# Altium schematic sheet wifi-module.SchDoc: EURO POWER WIFI (part 2 of 2)
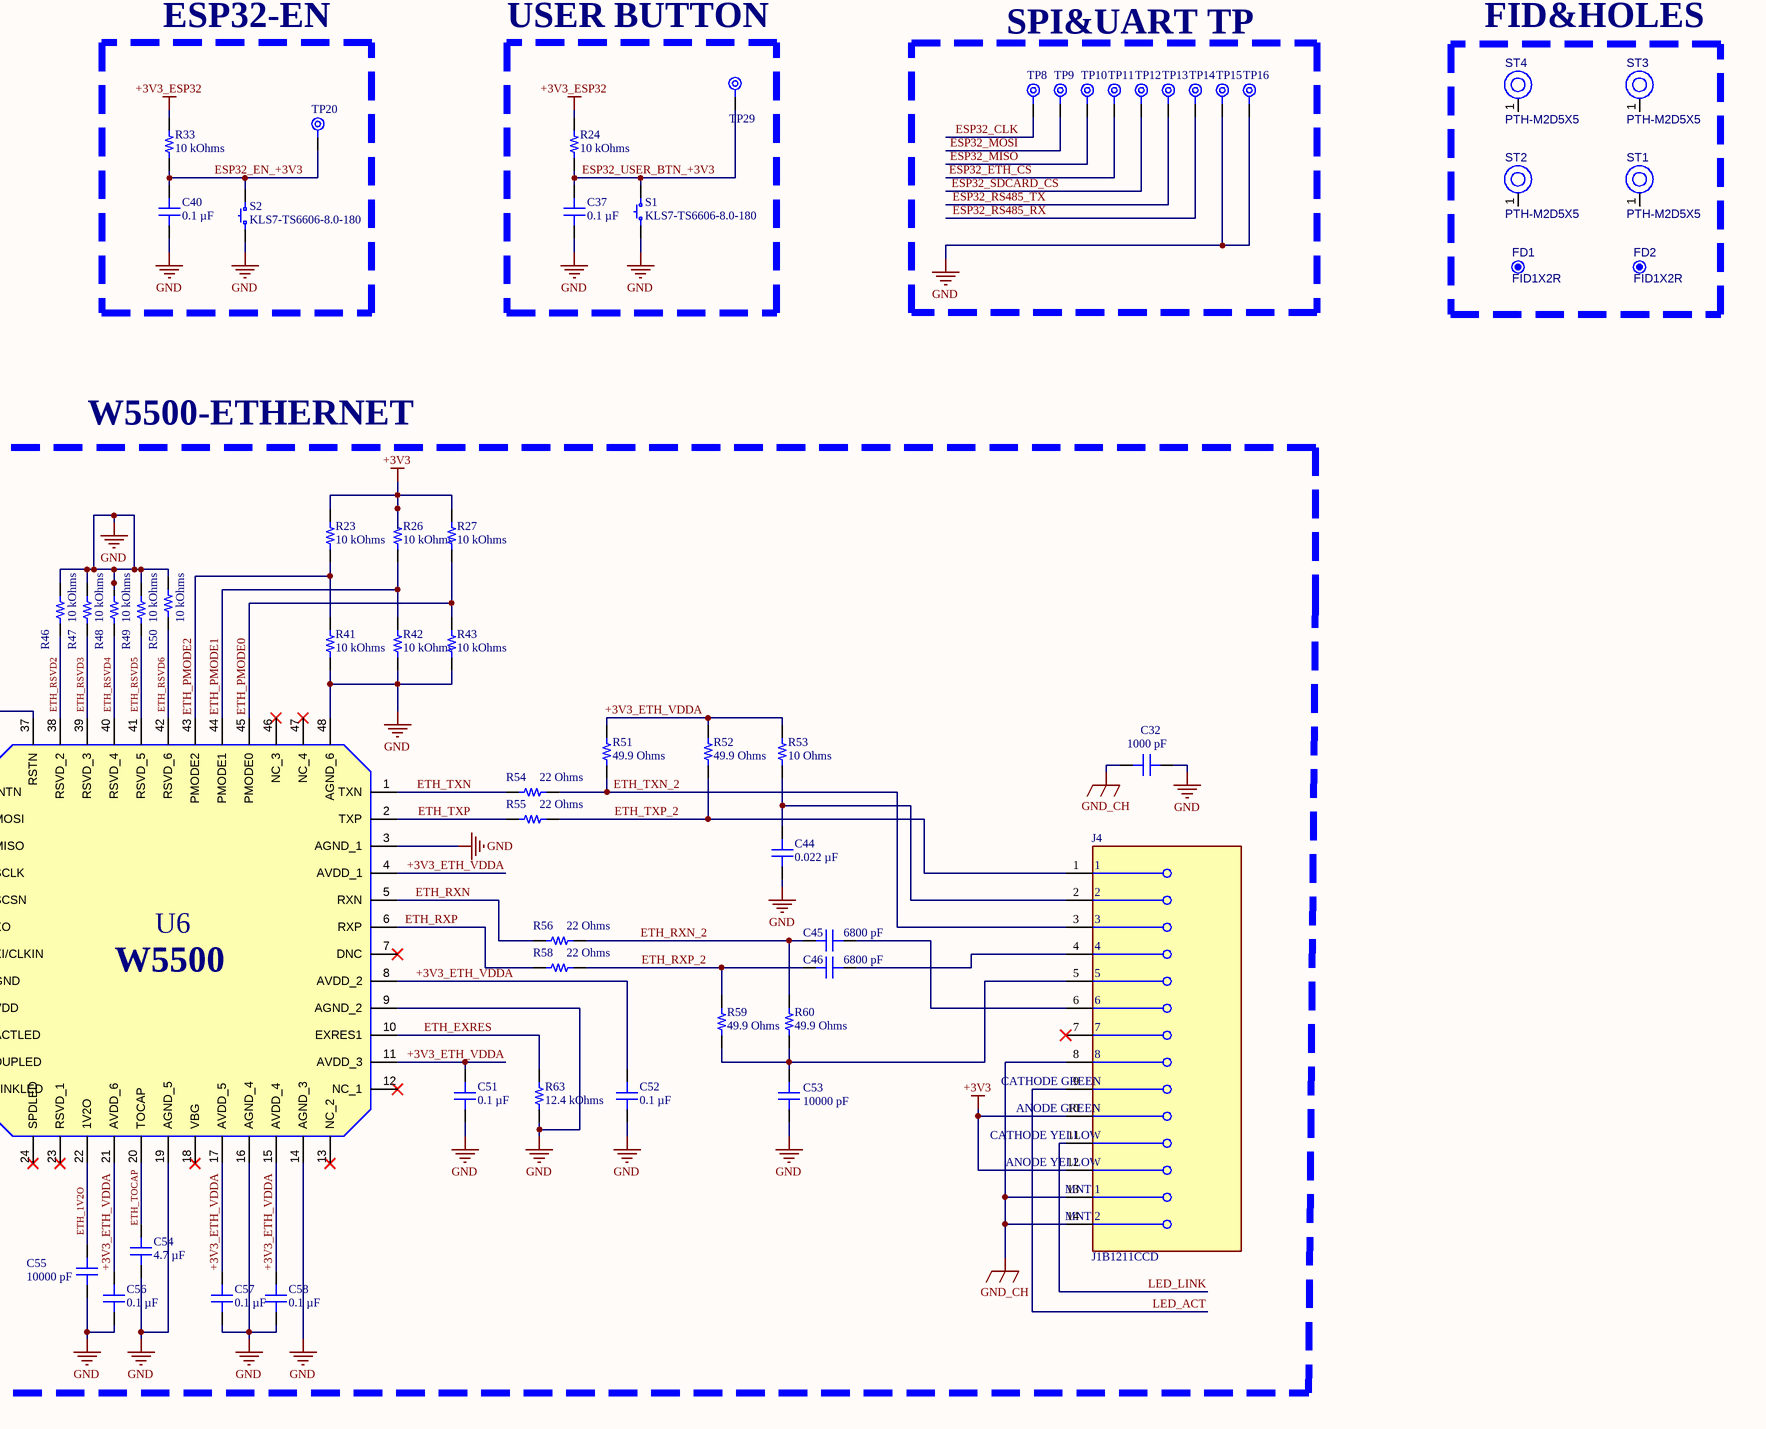
[diagram p4: wifi-module.SchDoc, bottom right]

## Library data of the parts
BR1 = ABS210: Bridge Rectifier; Manufacturer_Name: MDD; Datasheet Link: https://datasheet.lcsc.com/szlcsc/1903041530_MDD-Jiangsu-Yutai-Elec-ABS210_C113925.pdf; Height: 1.6mm; Manufacturer_Part_Number: ABS210
C1 C18 = CMP-214-008774-1: CAP CER 1000PF 50V X7R 0603; manufacturer: KEMET; Tolerance: ±10%; partid: 47213; Device Package: 0603 (1608 Metric); Lifecycle Status: Active; Operating Temperature: -55°C ~ 125°C; Capacitance: 1000 pF; lastupdated: 9/4/2023 7:08:10 PM; price: 0.01; Package / Case: 0603 (1608 Metric); Part Status: Active; series: SMD Auto X7R; Voltage - Rated: 50V; Part Number: C0603C102K5RACAUTO7411; ComponentLink1URL: https://connect.kemet.com:7667/gateway/IntelliData-ComponentDocumentation/1.0/download/datasheet/C0603C102K5RACAUTO7411; ComponentLink2URL: https://www.digikey.com/en/products/detail/kemet/C0603C102K5RACAUTO7411/11676491; Mounting Type: Surface Mount, MLCC; Ratings: AEC-Q200; Applications: Automotive, Bypass, Decoupling; ComponentLink2Description: DigiKey Link; packaging: TapeAndReel; Thickness (Max): 0.034" (0.87mm); Minimum Order: 1; Temperature Coefficient: X7R; Size / Dimension: 0.063" L x 0.031" W (1.60mm x 0.80mm); ComponentLink1Description: Datasheet
C2 C3 = CMP-001-00289-1: WCAP-ATG8 Aluminum Electrolytic Capacitor, Radial, THT, D8 x H11.5mm, 4.7uF, 400V; Manufacturer: Wurth Elektronik; Ripple Current: 55mA; Capacitance Tolerance: +/-20%; Leakage Current: 56.4uA; Simulation File: Simulations\WCAP-ATG8.ckt; Endurance: 2000h; Technical Reference: ATAE1154R7M400DSPA7B000; Simulation ModelName: 860011374005_4.7uF; Dissipation Factor: 15%; ComponentLink2URL: https://www.we-online.com/redexpert/spec/860011374005?ad; Operating Temperature Max: 85°C; Category: Aluminum Electrolytic Capacitors; Mount: Through Hole; Match Code: WCAP-ATG8; Height: 11.5mm; Diameter: 8mm; Rated Voltage (DC): 400V; Packaging: Ammo Pack; Manufacturer Part Number: 860011374005; ComponentLink1URL: https://www.we-online.com/redexpert/article/860011374005?ad; ComponentLink1Description: Website Link; Operating Temperature Min: -25°C; ComponentLink2Description: Datasheet Link
C4 C7 C8 C12 C16 C21 C24 C25 C28 C31 C34 C36 C37 C39 C40 C48 C50-C52 C56-C58 = CMP-214-002418-1: CAP CER 0.1UF 50V X7R 0603; manufacturer: Yageo; Tolerance: ±5%; Operating Temperature: -55°C ~ 125°C; Size / Dimension: 0.063" L x 0.031" W (1.60mm x 0.80mm); Minimum Order: 1; Capacitance: 0.1 µF; Temperature Coefficient: X7R; Thickness (Max): 0.035" (0.90mm); Lifecycle Status: Active; Part Number: CC0603JRX7R9BB104; ComponentLink2Description: DigiKey Link; lastupdated: 9/4/2023 7:08:38 PM; ComponentLink2URL: https://www.digikey.com/en/products/detail/yageo/CC0603JRX7R9BB104/5195188; Device Package: 0603 (1608 Metric); price: 0.01; partid: 12474; ComponentLink1Description: Datasheet; Applications: General Purpose; Mounting Type: Surface Mount, MLCC; Package / Case: 0603 (1608 Metric); Part Status: Active; ComponentLink1URL: https://www.yageo.com/upload/media/product/productsearch/datasheet/mlcc/UPY-GPHC_X7R_6.3V-to-50V_18.pdf; series: CC; Voltage - Rated: 50V; packaging: TapeAndReel
C5 C6 C9-C11 C15 C26 C41 = CMP-215-002141-1: CAP CER 10UF 25V X5R 0805; manufacturer: Samsung Electro-Mechanics; Tolerance: ±10%; ComponentLink2Description: DigiKey Link; Operating Temperature: -55°C ~ 85°C; Part Number: CL21A106KAYNNNE; ComponentLink1Description: Datasheet; Package / Case: 0805 (2012 Metric); series: CL; Minimum Order: 1; price: 0.02; Capacitance: 10 µF; Size / Dimension: 0.079" L x 0.049" W (2.00mm x 1.25mm); Voltage - Rated: 25V; Thickness (Max): 0.057" (1.45mm); partid: 13105; Device Package: 0805 (2012 Metric); Temperature Coefficient: X5R; Part Status: Active; Applications: General Purpose; Lifecycle Status: Active; ComponentLink2URL: https://www.digikey.com/en/products/detail/samsung-electro-mechanics/CL21A106KAYNNNE/3888549; lastupdated: 9/4/2023 7:11:56 PM; packaging: TapeAndReel; ComponentLink1URL: http://www.samsungsem.com/kr/support/product-search/mlcc/CL21A106KAYNNNE.jsp; Mounting Type: Surface Mount, MLCC
C13 = CMP-214-001809-1: CAP CER 0.022UF 50V X7R 0603; manufacturer: Samsung Electro-Mechanics; Tolerance: ±10%; Applications: General Purpose; ComponentLink2URL: https://www.digikey.com/en/products/detail/samsung-electro-mechanics/CL10B223KB8NNNC/3886762; Temperature Coefficient: X7R; Package / Case: 0603 (1608 Metric); Thickness (Max): 0.035" (0.90mm); packaging: TapeAndReel; ComponentLink1URL: http://www.samsungsem.com/kr/support/product-search/mlcc/CL10B223KB8NNNC.jsp; price: 0.01; Lifecycle Status: Active; Operating Temperature: -55°C ~ 125°C; Mounting Type: Surface Mount, MLCC; series: CL; partid: 9905; lastupdated: 9/4/2023 7:08:42 PM; Minimum Order: 1; Part Status: Active; Size / Dimension: 0.063" L x 0.031" W (1.60mm x 0.80mm); Voltage - Rated: 50V; Capacitance: 0.022 µF; Device Package: 0603 (1608 Metric); Part Number: CL10B223KB8NNNC; ComponentLink1Description: Datasheet; ComponentLink2Description: DigiKey Link
C14 = CMP-209-000859-1: CAP ALUM POLY 100UF 20% 35V SMD; manufacturer: KEMET; Surface Mount Land Size: 0.327" L x 0.327" W (8.30mm x 8.30mm); Ripple Current @ High Frequency: 1.4 A @ 100 kHz; Type: Polymer; Lifetime @ Temp.: 2000 Hrs @ 125°C; ESR (Equivalent Series Resistance): 36mOhm; Ripple Current @ Low Frequency: 70 mA @ 120 Hz; ComponentLink1URL: https://connect.kemet.com:7667/gateway/IntelliData-ComponentDocumentation/1.0/download/datasheet/A768KE107M1VLAE036; Tolerance: ±20%; packaging: TapeAndReel; Lifecycle Status: Active; Height - Seated (Max): 0.236" (6.00mm); Part Status: Active; price: 0.16; Voltage - Rated: 35 V; series: A768; lastupdated: 9/4/2023 8:34:42 PM; Size / Dimension: 0.315" Dia (8.00mm); Mounting Type: Surface Mount; Minimum Order: 1; Part Number: A768KE107M1VLAE036; partid: 5230; ComponentLink2URL: https://www.digikey.com/en/products/detail/kemet/A768KE107M1VLAE036/13420090; ComponentLink2Description: DigiKey Link; Capacitance: 100 µF; ComponentLink1Description: Datasheet; Operating Temperature: -55°C ~ 125°C; Applications: General Purpose
C17 C22 C53 C55 = CMP-214-000783-1: CAP CER 10000PF 50V X7R 0603; manufacturer: Samsung Electro-Mechanics; Tolerance: ±10%; Lifecycle Status: Active; Capacitance: 10000 pF; price: 0.01; Thickness (Max): 0.035" (0.90mm); Minimum Order: 1; Part Status: Active; Device Package: 0603 (1608 Metric); ComponentLink2Description: DigiKey Link; packaging: TapeAndReel; series: CL; Voltage - Rated: 50V; Size / Dimension: 0.063" L x 0.031" W (1.60mm x 0.80mm); lastupdated: 9/4/2023 7:08:47 PM; partid: 5498; ComponentLink1Description: Datasheet; ComponentLink2URL: https://www.digikey.com/en/products/detail/samsung-electro-mechanics/CL10B103KB8NNNC/3886667; Part Number: CL10B103KB8NNNC; Package / Case: 0603 (1608 Metric); Mounting Type: Surface Mount, MLCC; Temperature Coefficient: X7R; Operating Temperature: -55°C ~ 125°C; Applications: General Purpose; ComponentLink1URL: http://www.samsungsem.com/kr/support/product-search/mlcc/CL10B103KB8NNNC.jsp
C19 C23 C29 = CMP-214-001827-1: CAP CER 100PF 50V C0G/NP0 0603; manufacturer: Samsung Electro-Mechanics; Temperature Coefficient: C0G, NP0; Tolerance: ±5%; Voltage - Rated: 50V; Size / Dimension: 0.063" L x 0.031" W (1.60mm x 0.80mm); price: 0.01; series: CL; Operating Temperature: -55°C ~ 125°C; ComponentLink2Description: DigiKey Link; ComponentLink2URL: https://www.digikey.com/en/products/detail/samsung-electro-mechanics/CL10C101JB81PNC/3887820; Package / Case: 0603 (1608 Metric); Thickness (Max): 0.035" (0.90mm); Capacitance: 100 pF; Ratings: AEC-Q200; packaging: TapeAndReel; Lifecycle Status: Active; partid: 9987; Minimum Order: 1; ComponentLink1Description: Datasheet; Device Package: 0603 (1608 Metric); lastupdated: 9/4/2023 7:08:42 PM; Mounting Type: Surface Mount, MLCC; Part Number: CL10C101JB81PNC; Part Status: Active; ComponentLink1URL: http://www.samsungsem.com/kr/support/product-search/mlcc/CL10C101JB81PNC.jsp; Applications: Automotive
C20 C27 C33 C35 C38 C49 = CMP-214-007386-1: CAP CER 10UF 6.3V X5R 0603; manufacturer: Samsung Electro-Mechanics; Tolerance: ±20%; Part Status: Active; ComponentLink2Description: DigiKey Link; ComponentLink1URL: http://www.samsungsem.com/kr/support/product-search/mlcc/CL10A106MQ8NNNC.jsp; partid: 39822; Thickness (Max): 0.035" (0.90mm); Voltage - Rated: 6.3V; Device Package: 0603 (1608 Metric); Lifecycle Status: Active; Mounting Type: Surface Mount, MLCC; Operating Temperature: -55°C ~ 85°C; Temperature Coefficient: X5R; packaging: TapeAndReel; ComponentLink2URL: https://www.digikey.com/en/products/detail/samsung-electro-mechanics/CL10A106MQ8NNNC/3886777; Applications: General Purpose; series: CL; Part Number: CL10A106MQ8NNNC; Minimum Order: 1; Size / Dimension: 0.063" L x 0.031" W (1.60mm x 0.80mm); ComponentLink1Description: Datasheet; lastupdated: 9/4/2023 7:08:47 PM; Capacitance: 10 µF; Package / Case: 0603 (1608 Metric); price: 0.01
C30 = CMP-216-004562-1: CAP CER 2200PF 2KV X7R 1206; manufacturer: KEMET; Voltage - Rated: 2000V (2kV); Tolerance: ±10%; Mounting Type: Surface Mount, MLCC; price: 0.16; Package / Case: 1206 (3216 Metric); Operating Temperature: -55°C ~ 125°C; Lifecycle Status: Active; Device Package: 1206 (3216 Metric); ComponentLink2URL: https://www.digikey.com/en/products/detail/kemet/C1206X222KGRAC7800/6126197; lastupdated: 9/4/2023 7:14:42 PM; ComponentLink2Description: DigiKey Link; Part Status: Active; Thickness (Max): 0.073" (1.85mm); Temperature Coefficient: X7R; series: SMD Comm X7R HV Flex; ComponentLink1Description: Datasheet; Applications: Boardflex Sensitive; partid: 41595; Part Number: C1206X222KGRAC7800; packaging: TapeAndReel; Minimum Order: 1; Capacitance: 2200 pF; ComponentLink1URL: https://api.kemet.com/component-edge/download/datasheet/C1206X222KGRAC7800.pdf; Features: Low ESL, Soft Termination, High Voltage; Size / Dimension: 0.130" L x 0.063" W (3.30mm x 1.60mm)
C32 = CMP-216-005573-1: CAP CER 1000PF 2KV X7R 1206; manufacturer: Johanson Dielectrics Inc.; Tolerance: ±10%; Voltage - Rated: 2000V (2kV); Temperature Coefficient: X7R; packaging: TapeAndReel; Capacitance: 1000 pF; Applications: SMPS Filtering; Size / Dimension: 0.125" L x 0.062" W (3.18mm x 1.57mm); series: HVS-PME; ComponentLink1URL: https://www.johansondielectrics.com/downloads/catalog/johanson-dielectrics-product-catalog.pdf; Minimum Order: 1; ComponentLink2URL: https://www.digikey.com/en/products/detail/johanson-dielectrics-inc/VPDD202W102K1GV001E/1556359; Mounting Type: Surface Mount, MLCC; ComponentLink1Description: Datasheet; Package / Case: 1206 (3216 Metric); Features: High Voltage; Device Package: 1206 (3216 Metric); lastupdated: 9/4/2023 7:13:44 PM; ComponentLink2Description: DigiKey Link; Part Number: VPDD202W102K1GV001E; Operating Temperature: -55°C ~ 125°C; price: 0.02; Thickness (Max): 0.067" (1.70mm); Part Status: Active; partid: 47912; Lifecycle Status: Active
C42 = CMP-001-03429-1: WCAP-FTX2 Film Capacitor, THT, L15 x W7 x H12.5mm, 220nF, 275V; Manufacturer: Wurth Elektronik; Pitch: 12.5mm; Rate of Voltage Rise: 240V/us; Technical Reference: MX2P125224K275ASPB15000; Simulation ModelName: 890324024002_220nF; Dissipation Factor @1kHz: 0.1%; Dissipation Factor @100kHz: 2%; Insulation Resistance: 30GOhm; Simulation File: Simulations\WCAP-FTX2.ckt; Dissipation Factor @10kHz: 0.2%; Capacitance Tolerance: +/-10%; Manufacturer Part Number: 890324024002; Length: 15mm; Category: Film Capacitors; ComponentLink2Description: Datasheet Link; Operating Temperature Max: 105°C; Packaging: Carton; Match Code: WCAP-FTX2; ComponentLink1URL: https://www.we-online.com/redexpert/article/890324024002?ad; ComponentLink2URL: https://www.we-online.com/redexpert/spec/890324024002?ad; ComponentLink1Description: Website Link; Mount: Through Hole; Width: 7mm; Operating Temperature Min: -40°C; Rated Voltage (AC): 275V; Height: 12.5mm
C43 C47 = CMP-214-005657-1: CAP CER 0603 18PF 50V ULTRA STAB; manufacturer: KEMET; Temperature Coefficient: X8R; Tolerance: ±10%; price: 0.01; Minimum Order: 1; ComponentLink2Description: DigiKey Link; Device Package: 0603 (1608 Metric); Features: Low ESL, High Temperature; packaging: TapeAndReel; lastupdated: 9/4/2023 7:08:19 PM; Voltage - Rated: 50V; ComponentLink2URL: https://www.digikey.com/en/products/detail/kemet/C0603C180K5HACAUTO/7957267; Lifecycle Status: Active; Mounting Type: Surface Mount, MLCC; Part Number: C0603C180K5HACAUTO; Thickness (Max): 0.034" (0.87mm); ComponentLink1URL: https://api.kemet.com/component-edge/download/datasheet/C0603C180K5HACAUTO.pdf; Capacitance: 18 pF; Size / Dimension: 0.063" L x 0.031" W (1.60mm x 0.80mm); Ratings: AEC-Q200; partid: 35316; Applications: Automotive; Part Status: Active; Package / Case: 0603 (1608 Metric); ComponentLink1Description: Datasheet; Operating Temperature: -55°C ~ 150°C; series: SMD Auto X8R HT150C
C44 = CMP-214-009207-1: CAP CER 0.022UF 50V X7R 0603; manufacturer: KEMET; Tolerance: ±20%; packaging: TapeAndReel; price: 0.01; Applications: Automotive, Bypass, Decoupling; ComponentLink1Description: Datasheet; Size / Dimension: 0.063" L x 0.031" W (1.60mm x 0.80mm); Mounting Type: Surface Mount, MLCC; series: SMD Auto X7R; partid: 48455; ComponentLink2Description: DigiKey Link; Part Number: C0603C223M5RACAUTO; Package / Case: 0603 (1608 Metric); Ratings: AEC-Q200; Part Status: Active; Device Package: 0603 (1608 Metric); Capacitance: 0.022 µF; Temperature Coefficient: X7R; Minimum Order: 1; Operating Temperature: -55°C ~ 125°C; Thickness (Max): 0.034" (0.87mm); Lifecycle Status: Active; lastupdated: 9/4/2023 7:08:04 PM; ComponentLink2URL: https://www.digikey.com/en/products/detail/kemet/C0603C223M5RACAUTO/11676307; Voltage - Rated: 50V; ComponentLink1URL: https://connect.kemet.com:7667/gateway/IntelliData-ComponentDocumentation/1.0/download/datasheet/C0603C223M5RACAUTO
C45 C46 = CMP-214-005416-1: CAP CER 6800PF 50V X7R 0603; manufacturer: KEMET; Tolerance: ±10%; partid: 35033; ComponentLink1Description: Datasheet; price: 0.01; Part Status: Active; packaging: TapeAndReel; Device Package: 0603 (1608 Metric); Applications: Bypass, Decoupling; Part Number: C0603C682K5RAC7411; Voltage - Rated: 50V; ComponentLink2URL: https://www.digikey.com/en/products/detail/kemet/C0603C682K5RAC7411/12701123; Operating Temperature: -55°C ~ 125°C; ComponentLink2Description: DigiKey Link; ComponentLink1URL: https://api.kemet.com/component-edge/download/datasheet/C0603C682K5RAC7411.pdf; Mounting Type: Surface Mount, MLCC; Thickness (Max): 0.034" (0.87mm); Minimum Order: 1; Temperature Coefficient: X7R; series: SMD Comm X7R; Package / Case: 0603 (1608 Metric); Size / Dimension: 0.063" L x 0.031" W (1.60mm x 0.80mm); lastupdated: 9/4/2023 7:08:18 PM; Lifecycle Status: Active; Capacitance: 6800 pF
C54 = CMP-216-004449-1: CAP CER 4.7UF 50V X7R 1206; manufacturer: Samsung Electro-Mechanics; Tolerance: ±10%; Package / Case: 1206 (3216 Metric); partid: 40975; Operating Temperature: -55°C ~ 125°C; Thickness (Max): 0.071" (1.80mm); Part Status: Active; Lifecycle Status: Active; ComponentLink1Description: Datasheet; ComponentLink2Description: DigiKey Link; series: CL; Size / Dimension: 0.126" L x 0.063" W (3.20mm x 1.60mm); price: 0.05; Applications: General Purpose; Part Number: CL31B475KBHNNNE; Device Package: 1206 (3216 Metric); Capacitance: 4.7 µF; Minimum Order: 1; packaging: TapeAndReel; ComponentLink2URL: https://www.digikey.com/en/products/detail/samsung-electro-mechanics/CL31B475KBHNNNE/3888447; Temperature Coefficient: X7R; Voltage - Rated: 50V; ComponentLink1URL: http://www.samsungsem.com/kr/support/product-search/mlcc/CL31B475KBHNNNE.jsp; Mounting Type: Surface Mount, MLCC; lastupdated: 9/4/2023 7:14:47 PM
D3 D4 = CMP-254-002514-1: SCHOTTKY 40V SOD-123FL; Manufacturer: SMC Diode Solutions; Capacitance @ Vr, F: 110pF @ 4V, 1MHz; Current - Reverse Leakage @ Vr: 100 µA @ 40 V; Current - Average Rectified (Io): 1A; Speed: Fast Recovery =< 500ns, > 200mA (Io); Voltage - Forward (Vf) (Max) @ If: 500 mV @ 1 A; Price: 0.03; Packaging: TapeAndReel; PartId: 2515; ComponentLink2URL: https://www.digikey.com/en/products/detail/smc-diode-solutions/DSS14UTR/8341859; Part Number: DSS14UTR; Diode Type: Schottky; ComponentLink2Description: DigiKey Link; Voltage - DC Reverse (Vr) (Max): 40 V; ComponentLink1URL: http://www.smc-diodes.com/propdf/DSS12U%20THRU%20DSS125U%20N1873%20REV.A.pdf; Supplier Device Package: SOD-123FL; Minimum Order: 1; Part Status: Active; ComponentLink1Description: Datasheet; LastUpdated: 9/4/2023 8:16:26 PM; Package / Case: SOD-123F; Series: -; Operating Temperature - Junction: -55°C ~ 150°C; Lifecycle Status: Active; Mounting Type: Surface Mount
D5 = CMP-004-00002-2: Fast Switching Diode, 75 V, 0.3 A, -65 to 150 degC, 2-Pin SOD323, RoHS, Tape and Reel; Manufacturer: Diodes Inc; Peak Reverse Current: 1uA; Max Surge Current: 2A; Elements: 1; Forward Current: 300mA; Recovery Time: 4ns; Forward Voltage: 1.25V; Datasheet Version: Rev. 25-2, 03/2016; Case/Package: SOD; Min Operating Temperature: -65°C; RoHS Compliant: True; Max Operating Temperature: 150°C; Manufacturer URL: http://www.diodes.com/; Pins: 2; Package Quantity: 3000; Datasheet URL: http://www.diodes.com/datasheets/ds30097.pdf; Packaging: TapeandReel; Package Description: 2-Pin Small Outline Diode, Body 1.7 x 1.3 mm; Mounting Technology: SM; Package Reference: SOD323-2
D6 = CMP-254-000890-1: DIODE GEN PURP 1KV 1A DO214AC; Manufacturer: Micro Commercial Co; Current - Reverse Leakage @ Vr: 5 µA @ 1000 V; Voltage - Forward (Vf) (Max) @ If: 1.5 V @ 1 A; Diode Type: Standard; Capacitance @ Vr, F: 8pF @ 4V, 1MHz; Speed: Fast Recovery =< 500ns, > 200mA (Io); Voltage - DC Reverse (Vr) (Max): 1000 V; Reverse Recovery Time (trr): 120 ns; Mounting Type: Surface Mount; Part Number: US1ML-TP; Current - Average Rectified (Io): 1A; Operating Temperature - Junction: -55°C ~ 150°C; Supplier Device Package: DO-214AC (SMA); Packaging: TapeAndReel; PartId: 891; Minimum Order: 1; ComponentLink1Description: Datasheet; Price: 0.04; LastUpdated: 9/4/2023 8:16:02 PM; ComponentLink2URL: https://www.digikey.com/en/products/detail/micro-commercial-co/US1ML-TP/7681879; Lifecycle Status: Active; Series: -; ComponentLink1URL: https://www.mccsemi.com/pdf/Products/US1ML(DO-214AC)-A.pdf; ComponentLink2Description: DigiKey Link; Package / Case: DO-214AC, SMA; Part Status: Active
D7 = CMP-254-000169-1: DIODE GEN PURP 600V 3A SMB; Manufacturer: Bourns Inc.; Voltage - Forward (Vf) (Max) @ If: 1V @ 1A; Speed: Standard Recovery >500ns, > 200mA (Io); Capacitance @ Vr, F: 40pF @ 4V, 1MHz; Current - Reverse Leakage @ Vr: 5µA @ 600V; Diode Type: Standard; Current - Average Rectified (Io): 3A; Package / Case: DO-214AA, SMB; ComponentLink1URL: https://www.bourns.com/docs/Product-Datasheets/CD214B-R350_R31000.pdf; Lifecycle Status: Active; Supplier Device Package: DO-214AA (SMB); Mounting Type: Surface Mount; Price: 0.13; Minimum Order: 1; ComponentLink2URL: http://digikey.com/product-detail/en/bourns-inc/CD214B-R3600/CD214B-R3600CT-ND/5774992; Packaging: TapeAndReel; Part Status: Active; Series: -; PartId: 170; LastUpdated: 9/4/2023 8:15:30 PM; ComponentLink2Description: DigiKey Link; Voltage - DC Reverse (Vr) (Max): 600V; Part Number: CD214B-R3600; ComponentLink1Description: Datasheet; Operating Temperature - Junction: -65°C ~ 175°C
D8 = CMP-00104-4: Trans Voltage Suppressor Diode, 5V V(RWM), Unidirectional, 1 Element, Silicon
D9 = CMP-557-000000-1: 26V, 12V Clamp 17A (8/20µs) Ipp Tvs Diode Surface Mount SOT-23-3; Manufacturer Name: SMC Diode Solutions; ComponentLink1URL: https://www.smc-diodes.com/propdf/SM712%20N2270%20REV.A.pdf; ComponentLink1Description: Datasheet; Source: controller_board.SchLib; Part Number: SM712; Design Item ID: SM712
D11 = CMP-007-00083-1: Addressable Lighting - LED Serial NRZ (Shift Register) Red, Green, Blue (RGB)
FB1-FB10 = CMP-264-000816-1: FERRITE BEAD 100 OHM 0603 1LN; Manufacturer: TDK Corporation; Number of Lines: 1; Impedance @ Frequency: 100 Ohms @ 100 MHz; Filter Type: Power Line; DC Resistance (DCR) (Max): 30mOhm; Current Rating (Max): 3A; Value: 100 Ohms @ 100 MHz; Operating Temperature: -55°C ~ 125°C; Price: 0.02; ComponentLink2Description: DigiKey Link; Mounting Type: Surface Mount; Part Status: Active; Size / Dimension: 0.063" L x 0.032" W (1.60mm x 0.80mm); Packaging: TapeAndReel; Lifecycle Status: Active; Device Package: 0603 (1608 Metric); Series: MPZ; PartId: 841; ComponentLink1URL: https://product.tdk.com/info/en/catalog/datasheets/beads_commercial_power_mpz1608_en.pdf?ref_disty=digikey; Height (Max): 0.030" (0.75mm); Minimum Order: 1; ComponentLink2URL: https://www.digikey.com/en/products/detail/tdk-corporation/MPZ1608S101ATAH0/571871; Part Number: MPZ1608S101ATAH0; ComponentLink1Description: Datasheet; Package / Case: 0603 (1608 Metric); LastUpdated: 9/4/2023 8:13:24 PM
FD1 FD2 = CMP-00028-00005-2: Fiducial - Round 1x2mm; Pins: 0
J1 J3 = CMP-244-000014-2: TERM BLK 2P SIDE ENT 5.08MM PCB; Manufacturer: TE Connectivity AMP Connectors; Voltage: 300 V; Pitch: 0.200" (5.08mm); Wire Gauge: 16-28 AWG; Mating Orientation: Horizontal with Board; Wire Termination: Screw - Rising Cage Clamp; Number of Levels: 1; Positions Per Level: 2; Features: Interlocking (Side); Part Status: Active; Price: 0.31; Packaging: Tray; ComponentLink2URL: https://www.digikey.com/en/products/detail/te-connectivity-amp-connectors/282837-2/2187973; Part Number: 282837-2; Lifecycle Status: Active; Series: Buchanan; ComponentLink2Description: DigiKey Link; ComponentLink1Description: Datasheet; Color: Green; Mounting Type: Through Hole; Minimum Order: 1; ComponentLink1URL: https://www.te.com/commerce/DocumentDelivery/DDEController?Action=srchrtrv&DocNm=282837&DocType=Customer+Drawing&DocLang=English; LastUpdated: 6/21/2022 3:00:23 PM
J2 = CMP-245-000003-1: CONN RCPT USB2.0 MICRO B SMD R/A; Manufacturer: Amphenol ICC (FCI); Gender: Receptacle; Number of Contacts: 5; Connector Type: USB - micro B; Voltage - Rated: 100VAC; Shielding: Shielded; Mating Cycles: 10000; Number of Ports: 1; Current Rating (Amps): 1.8A per Contact; Termination: Solder; Mounting Feature: Horizontal; Specifications: USB 2.0; Operating Temperature: -30°C ~ 80°C; Minimum Order: 1; Part Status: Active; ComponentLink1URL: https://cdn.amphenol-icc.com/media/wysiwyg/files/documentation/datasheet/inputoutput/io_usb_micro.pdf; Mounting Type: Surface Mount, Right Angle; Through Hole; Lifecycle Status: 0; Features: Solder Retention; LastUpdated: 12/9/2019 8:51:28 PM; Series: -; Packaging: TapeAndReel; Part Number: 10118193-0001LF; Price: 0.21; ComponentLink1Description: Datasheet
J4 = CMP-240752-000001-1: CONN JACK 1PORT 100 BASE-T PCB; Number of Cores per Jack: 4; Direction: Down; Connector Type: RJ45; Shielding: Shielded; Number of Ports: 1; Termination: Solder; Packaging: Bulk; Contact Material: Brass; Color: Green; Number of Rows: 1; Mount: Through Hole; Series: -; Contact Plating: Gold; Max Operating Temperature: 85°C; Min Operating Temperature: -40°C; Housing Material: Thermoplastic
L1 L2 = CMP-07248-000082-1: FIXED IND 1MH 420MA 2.1 OHM TH; Lead/Base Style: Radial; Shielding: Unshielded; DC Resistance (DCR): 2.1R; Max DC Current: 300mA; Core Material: Ferrite; Inductance Tolerance: 10%; Test Frequency: 252kHz; Material: Steel; Self Resonant Frequency: 1.3MHz; Q Factor: 40; Lead Diameter: 0.65mm; Termination: Radial; Resistor Type: Wirewound; Min Operating Temperature: -40°C; Mount: Through Hole; Radiation Hardening: No; Military Standard: Not; RMS Current (Irms): 300mA; Height - Seated (Max): 0.512inch; Series: RLB; Length: 12mm; Resistance: 2.1R; Lead Pitch: 5mm; Number of Pins: 2; Height: 12mm; REACH SVHC: No SVHC; Packaging: Bulk; Package Quantity: 200; Max Operating Temperature: 105°C; Tolerance: 10%; Diameter: 8.7mm; Case/Package: Radial; Body Material: Ferrite; Orientation: Vertical; DC Current: 300mA; Current Rating: 300mA; RoHS Compliant: Yes
PI1 = B0505S-2WR3: Isolated Power Modules; Manufacturer_Name: YLPTEC; Datasheet Link: https://www.lcsc.com/datasheet/lcsc_datasheet_2304271700_YLPTEC-B0505S-2WR3_C5369473.pdf; Height: 1.6mm; Manufacturer_Part_Number: B0505S-2WR3
R1 R6 = CMP-327-006874-1: RES 22K OHM 1% 1/10W 0603; Manufacturer: Yageo; Power (Watts): 0.1W, 1/10W; Temperature Coefficient: ±100ppm/°C; Height - Seated (Max): 0.022" (0.55mm); Packaging: CutTape; Part Number: RC0603FR-0722KL; ComponentLink2Description: DigiKey Link; ComponentLink1Description: Datasheet; Composition: Thick Film; Tolerance: ±1%; Series: RC_L; LastUpdated: 9/4/2023 7:33:21 PM; PartId: 18937; ComponentLink2URL: https://www.digikey.com/en/products/detail/yageo/RC0603FR-0722KL/727056; Device Package: 0603 (1608 Metric); ComponentLink1URL: https://www.yageo.com/upload/media/product/productsearch/datasheet/rchip/PYu-RC_Group_51_RoHS_L_10.pdf; Size / Dimension: 0.063" L x 0.031" W (1.60mm x 0.80mm); Part Status: Active; Minimum Order: 1; Package / Case: 0603 (1608 Metric); Supplier Device Package: 0603; Price: 0.01; Resistance: 22 kOhms; Features: Moisture Resistant; Operating Temperature: -55°C ~ 155°C; Lifecycle Status: Active; Number of Terminations: 2
R2 = CMP-07402-000008-1: VARISTOR 430V 4.5KA DISC 14MM; Manufacturer: Bourns Inc.; Voltage Tolerance: 10%; Varistor Voltage: 387V; Voltage Rating Ac: 275V; Capacitance: 552pF; Voltage Rating Dc: 350V; Value: 552pF; Clamping Current: 50A; Clamping Voltage: 710V; Mouser Description: Varistors 430volts 14mm; Temperature Range High: +105°C; RoHS: TRUE; ComponentLink2Description: Datasheet; Height: 20mm; Temperature: -40°C to +105°C; ComponentLink2URL: https://www.bourns.com/data/global/pdfs/MOV14D.pdf; Digikey Description: VARISTOR 430V 4.5KA DISC 14MM; Device Class L3: unset; Temperature Range Low: -40°C; Automotive: No; Device Class L1: Circuit Protection; Manufacturer Part Number: MOV-14D431K; Device Class L2: Varistors; Package: 0; Category: Res; Lead Free: Yes; Octopart: https://octopart.com/mov-14d431k-bourns-21388914
R3 = CMP-327-006911-1: RES 2.7K OHM 1% 1/10W 0603; Manufacturer: Yageo; Temperature Coefficient: ±100ppm/°C; Power (Watts): 0.1W, 1/10W; Features: Moisture Resistant; Part Status: Active; Series: RC_L; Package / Case: 0603 (1608 Metric); PartId: 19013; ComponentLink1Description: Datasheet; Price: 0.01; Size / Dimension: 0.063" L x 0.031" W (1.60mm x 0.80mm); ComponentLink2URL: https://www.digikey.com/en/products/detail/yageo/RC0603FR-072K7L/727032; Part Number: RC0603FR-072K7L; ComponentLink1URL: https://www.yageo.com/upload/media/product/productsearch/datasheet/rchip/PYu-RC_Group_51_RoHS_L_10.pdf; Resistance: 2.7 kOhms; LastUpdated: 9/4/2023 7:33:21 PM; ComponentLink2Description: DigiKey Link; Height - Seated (Max): 0.022" (0.55mm); Packaging: CutTape; Lifecycle Status: Active; Operating Temperature: -55°C ~ 155°C; Supplier Device Package: 0603; Device Package: 0603 (1608 Metric); Minimum Order: 1; Tolerance: ±1%; Composition: Thick Film; Number of Terminations: 2
R4 R5 = CMP-331-002954-1: RES 1M OHM 5% 1W 2512; Manufacturer: Stackpole Electronics Inc; Temperature Coefficient: ±200ppm/°C; Lifecycle Status: Active; Resistance: 1 MOhms; Part Number: RMCF2512JT1M00; Size / Dimension: 0.248" L x 0.126" W (6.30mm x 3.20mm); ComponentLink1Description: Datasheet; Power (Watts): 1W; Composition: Thick Film; LastUpdated: 9/2/2020 1:27:04 AM; Device Package: 2512 (6432 Metric); Part Status: Active; ComponentLink2URL: http://digikey.com/product-detail/en/stackpole-electronics-inc/RMCF2512JT1M00/RMCF2512JT1M00CT-ND/7907175; Height - Seated (Max): 0.028" (0.70mm); ComponentLink2Description: DigiKey Link; Tolerance: ±5%; Price: 0.03; Series: RMCF; Package / Case: 2512 (6432 Metric); Supplier Device Package: 2512; Features: Automotive AEC-Q200; Ratings: AEC-Q200; ComponentLink1URL: https://www.seielect.com/catalog/sei-rmcf_rmcp.pdf; Packaging: TapeAndReel; Number of Terminations: 2; Operating Temperature: -55°C ~ 155°C; Minimum Order: 1
R7 = CMP-327-006920-1: RES 56K OHM 1% 1/10W 0603; Manufacturer: Yageo; Power (Watts): 0.1W, 1/10W; Temperature Coefficient: ±100ppm/°C; Number of Terminations: 2; Price: 0.01; Composition: Thick Film; ComponentLink2Description: DigiKey Link; PartId: 19031; Operating Temperature: -55°C ~ 155°C; Lifecycle Status: Active; ComponentLink1Description: Datasheet; Series: RC_L; Device Package: 0603 (1608 Metric); Height - Seated (Max): 0.022" (0.55mm); Package / Case: 0603 (1608 Metric); LastUpdated: 9/4/2023 7:33:20 PM; Minimum Order: 1; ComponentLink1URL: https://www.yageo.com/upload/media/product/productsearch/datasheet/rchip/PYu-RC_Group_51_RoHS_L_10.pdf; Features: Moisture Resistant; Part Status: Active; Resistance: 56 kOhms; Part Number: RC0603FR-0756KL; ComponentLink2URL: https://www.digikey.com/en/products/detail/yageo/RC0603FR-0756KL/2827626; Tolerance: ±1%; Packaging: CutTape; Size / Dimension: 0.063" L x 0.031" W (1.60mm x 0.80mm); Supplier Device Package: 0603
R8 = CMP-327-006898-1: RES 5.6K OHM 1% 1/10W 0603; Manufacturer: Yageo; Power (Watts): 0.1W, 1/10W; Temperature Coefficient: ±100ppm/°C; Price: 0.01; Features: Moisture Resistant; Tolerance: ±1%; Lifecycle Status: Active; ComponentLink2Description: DigiKey Link; ComponentLink1Description: Datasheet; LastUpdated: 9/4/2023 7:33:21 PM; Composition: Thick Film; ComponentLink2URL: https://www.digikey.com/en/products/detail/yageo/RC0603FR-075K6L/727275; Operating Temperature: -55°C ~ 155°C; Package / Case: 0603 (1608 Metric); ComponentLink1URL: https://www.yageo.com/upload/media/product/productsearch/datasheet/rchip/PYu-RC_Group_51_RoHS_L_10.pdf; Minimum Order: 1; Height - Seated (Max): 0.022" (0.55mm); Series: RC_L; PartId: 18987; Number of Terminations: 2; Supplier Device Package: 0603; Resistance: 5.6 kOhms; Part Status: Active; Device Package: 0603 (1608 Metric); Packaging: CutTape; Size / Dimension: 0.063" L x 0.031" W (1.60mm x 0.80mm); Part Number: RC0603FR-075K6L
R9 R21 = CMP-327-010151-1: RES 2.2K OHM 1% 1/10W 0603; Manufacturer: Yageo; Temperature Coefficient: ±100ppm/°C; Power (Watts): 0.1W, 1/10W; Part Status: Active; Device Package: 0603 (1608 Metric); Tolerance: ±1%; Size / Dimension: 0.063" L x 0.031" W (1.60mm x 0.80mm); LastUpdated: 9/4/2023 7:32:58 PM; Supplier Device Package: 0603; Part Number: RC0603FR-072K2L; Series: RC_L; ComponentLink1URL: https://www.yageo.com/upload/media/product/productsearch/datasheet/rchip/PYu-RC_Group_51_RoHS_L_10.pdf; Height - Seated (Max): 0.022" (0.55mm); ComponentLink1Description: Datasheet; Composition: Thick Film; Features: Moisture Resistant; Package / Case: 0603 (1608 Metric); Resistance: 2.2 kOhms; Lifecycle Status: Active; Operating Temperature: -55°C ~ 155°C; Number of Terminations: 2; Minimum Order: 1; ComponentLink2Description: DigiKey Link; ComponentLink2URL: https://www.digikey.com/en/products/detail/yageo/RC0603FR-072K2L/727016; PartId: 23950; Price: 0.01; Packaging: CutTape
R10 R13-R15 R19 R29 R30 R34-R40 R54-R56 R58 = CMP-327-006887-1: RES 22 OHM 1% 1/10W 0603; Manufacturer: Yageo; Power (Watts): 0.1W, 1/10W; Temperature Coefficient: ±100ppm/°C; Price: 0.01; Device Package: 0603 (1608 Metric); Tolerance: ±1%; LastUpdated: 9/4/2023 7:33:21 PM; Lifecycle Status: Active; Package / Case: 0603 (1608 Metric); Features: Moisture Resistant; ComponentLink2Description: DigiKey Link; Operating Temperature: -55°C ~ 155°C; Height - Seated (Max): 0.022" (0.55mm); Series: RC_L; ComponentLink1Description: Datasheet; Part Number: RC0603FR-0722RL; Supplier Device Package: 0603; ComponentLink2URL: https://www.digikey.com/en/products/detail/yageo/RC0603FR-0722RL/727055; Size / Dimension: 0.063" L x 0.031" W (1.60mm x 0.80mm); Composition: Thick Film; PartId: 18963; Packaging: CutTape; ComponentLink1URL: https://www.yageo.com/upload/media/product/productsearch/datasheet/rchip/PYu-RC_Group_51_RoHS_L_10.pdf; Resistance: 22 Ohms; Minimum Order: 1; Part Status: Active; Number of Terminations: 2
R11 R16 R18 R20 R23 R24 R26-R28 R31-R33 R41-R50 = CMP-327-008800-1: RES 10K OHM 1% 1/10W 0603; Manufacturer: Yageo; Power (Watts): 0.1W, 1/10W; Temperature Coefficient: ±100ppm/°C; Packaging: CutTape; Resistance: 10 kOhms; Lifecycle Status: Active; Supplier Device Package: 0603; Features: Moisture Resistant; Minimum Order: 1; PartId: 22599; Package / Case: 0603 (1608 Metric); LastUpdated: 9/4/2023 7:33:07 PM; Part Number: RC0603FR-0710KL; ComponentLink1Description: Datasheet; Composition: Thick Film; Device Package: 0603 (1608 Metric); Height - Seated (Max): 0.022" (0.55mm); Series: RC_L; Size / Dimension: 0.063" L x 0.031" W (1.60mm x 0.80mm); Tolerance: ±1%; Number of Terminations: 2; ComponentLink2Description: DigiKey Link; Part Status: Active; Price: 0.01; ComponentLink2URL: https://www.digikey.com/en/products/detail/yageo/RC0603FR-0710KL/726880; Operating Temperature: -55°C ~ 155°C; ComponentLink1URL: https://www.yageo.com/upload/media/product/productsearch/datasheet/rchip/PYu-RC_Group_51_RoHS_L_10.pdf
R12 R17 = CMP-327-006952-1: RES 60.4 OHM 1% 1/10W 0603; Manufacturer: Yageo; Temperature Coefficient: ±100ppm/°C; Power (Watts): 0.1W, 1/10W; ComponentLink2URL: https://www.digikey.com/en/products/detail/yageo/RC0603FR-0760R4L/727327; Tolerance: ±1%; ComponentLink1Description: Datasheet; Size / Dimension: 0.063" L x 0.031" W (1.60mm x 0.80mm); ComponentLink2Description: DigiKey Link; Height - Seated (Max): 0.022" (0.55mm); Package / Case: 0603 (1608 Metric); Price: 0.01; Lifecycle Status: Active; Minimum Order: 1; Operating Temperature: -55°C ~ 155°C; Resistance: 60.4 Ohms; Packaging: CutTape; Device Package: 0603 (1608 Metric); Supplier Device Package: 0603; LastUpdated: 9/4/2023 7:33:20 PM; Composition: Thick Film; ComponentLink1URL: https://www.yageo.com/upload/media/product/productsearch/datasheet/rchip/PYu-RC_Group_51_RoHS_L_10.pdf; Part Status: Active; Part Number: RC0603FR-0760R4L; Features: Moisture Resistant; Number of Terminations: 2; PartId: 19096; Series: RC_L
R22 = CMP-329-006611-1: RES 1M OHM 1% 1/4W 1206; Manufacturer: Yageo; Power (Watts): 0.25W, 1/4W; Temperature Coefficient: ±100ppm/°C; Package / Case: 1206 (3216 Metric); Supplier Device Package: 1206; Height - Seated (Max): 0.026" (0.65mm); ComponentLink1URL: https://www.yageo.com/upload/media/product/productsearch/datasheet/rchip/PYu-RC_Group_51_RoHS_L_10.pdf; Tolerance: ±1%; Minimum Order: 1; PartId: 39213; ComponentLink1Description: Datasheet; Size / Dimension: 0.122" L x 0.063" W (3.10mm x 1.60mm); Part Status: Active; Device Package: 1206 (3216 Metric); Series: RC_L; Part Number: RC1206FR-071ML; Packaging: TapeAndReel; LastUpdated: 9/4/2023 7:43:30 PM; ComponentLink2Description: DigiKey Link; Lifecycle Status: Active; Price: 0.01; ComponentLink2URL: https://www.digikey.com/en/products/detail/yageo/RC1206FR-071ML/728388; Composition: Thick Film; Resistance: 1 MOhms; Operating Temperature: -55°C ~ 155°C; Features: Moisture Resistant; Number of Terminations: 2
R25 R61 R62 = CMP-327-008801-1: RES 1K OHM 1% 1/10W 0603; Manufacturer: Yageo; Temperature Coefficient: ±100ppm/°C; Power (Watts): 0.1W, 1/10W; LastUpdated: 9/4/2023 7:33:07 PM; Price: 0.01; ComponentLink2URL: https://www.digikey.com/en/products/detail/yageo/RC0603FR-071KL/726843; Series: RC_L; Features: Moisture Resistant; Resistance: 1 kOhms; Package / Case: 0603 (1608 Metric); Part Status: Active; Packaging: CutTape; Lifecycle Status: Active; Height - Seated (Max): 0.022" (0.55mm); Minimum Order: 1; ComponentLink1Description: Datasheet; Operating Temperature: -55°C ~ 155°C; Part Number: RC0603FR-071KL; Device Package: 0603 (1608 Metric); Supplier Device Package: 0603; Tolerance: ±1%; Composition: Thick Film; PartId: 22600; ComponentLink2Description: DigiKey Link; ComponentLink1URL: https://www.yageo.com/upload/media/product/productsearch/datasheet/rchip/PYu-RC_Group_51_RoHS_L_10.pdf; Number of Terminations: 2; Size / Dimension: 0.063" L x 0.031" W (1.60mm x 0.80mm)
R51 R52 R59 R60 = CMP-327-010152-1: RES 49.9 OHM 1% 1/10W 0603; Manufacturer: Yageo; Temperature Coefficient: ±100ppm/°C; Power (Watts): 0.1W, 1/10W; Minimum Order: 1; Package / Case: 0603 (1608 Metric); Part Status: Active; Device Package: 0603 (1608 Metric); Height - Seated (Max): 0.022" (0.55mm); LastUpdated: 9/4/2023 7:32:58 PM; Number of Terminations: 2; ComponentLink1URL: https://www.yageo.com/upload/media/product/productsearch/datasheet/rchip/PYu-RC_Group_51_RoHS_L_10.pdf; Operating Temperature: -55°C ~ 155°C; Tolerance: ±1%; Composition: Thick Film; Size / Dimension: 0.063" L x 0.031" W (1.60mm x 0.80mm); Series: RC_L; Packaging: CutTape; Supplier Device Package: 0603; Features: Moisture Resistant; Price: 0.01; Part Number: RC0603FR-0749R9L; ComponentLink2URL: https://www.digikey.com/en/products/detail/yageo/RC0603FR-0749R9L/727264; ComponentLink1Description: Datasheet; ComponentLink2Description: DigiKey Link; PartId: 23951; Resistance: 49.9 Ohms; Lifecycle Status: Active
R53 = CMP-327-008808-1: RES 10 OHM 1% 1/10W 0603; Manufacturer: Yageo; Power (Watts): 0.1W, 1/10W; Temperature Coefficient: ±200ppm/°C; PartId: 22607; Device Package: 0603 (1608 Metric); Resistance: 10 Ohms; Price: 0.01; Operating Temperature: -55°C ~ 155°C; ComponentLink2Description: DigiKey Link; Package / Case: 0603 (1608 Metric); ComponentLink1Description: Datasheet; Features: Moisture Resistant; Series: RC_L; Minimum Order: 1; Packaging: TapeAndReel; LastUpdated: 9/4/2023 7:33:07 PM; Part Number: RC0603FR-0710RL; Part Status: Active; Height - Seated (Max): 0.022" (0.55mm); Number of Terminations: 2; Supplier Device Package: 0603; ComponentLink1URL: https://www.yageo.com/upload/media/product/productsearch/datasheet/rchip/PYu-RC_Group_51_RoHS_L_10.pdf; Lifecycle Status: Active; Size / Dimension: 0.063" L x 0.031" W (1.60mm x 0.80mm); Composition: Thick Film; ComponentLink2URL: https://www.digikey.com/en/products/detail/yageo/RC0603FR-0710RL/726879; Tolerance: ±1%
R57 = CMP-327-008803-1: RES 1M OHM 1% 1/10W 0603; Manufacturer: Yageo; Power (Watts): 0.1W, 1/10W; Temperature Coefficient: ±100ppm/°C; Composition: Thick Film; Minimum Order: 1; Device Package: 0603 (1608 Metric); Number of Terminations: 2; Operating Temperature: -55°C ~ 155°C; Series: RC_L; LastUpdated: 9/4/2023 7:33:07 PM; Part Status: Active; Part Number: RC0603FR-071ML; Lifecycle Status: Active; Tolerance: ±1%; Height - Seated (Max): 0.022" (0.55mm); Packaging: CutTape; Size / Dimension: 0.063" L x 0.031" W (1.60mm x 0.80mm); PartId: 22602; Price: 0.01; ComponentLink2URL: https://www.digikey.com/en/products/detail/yageo/RC0603FR-071ML/726844; ComponentLink1Description: Datasheet; Resistance: 1 MOhms; Supplier Device Package: 0603; Features: Moisture Resistant; ComponentLink1URL: https://www.yageo.com/upload/media/product/productsearch/datasheet/rchip/PYu-RC_Group_51_RoHS_L_10.pdf; ComponentLink2Description: DigiKey Link; Package / Case: 0603 (1608 Metric)
R63 = CMP-327-006957-1: RES 12.4K OHM 1% 1/10W 0603; Manufacturer: Yageo; Power (Watts): 0.1W, 1/10W; Temperature Coefficient: ±100ppm/°C; Minimum Order: 1; Supplier Device Package: 0603; Lifecycle Status: Active; ComponentLink1URL: https://www.yageo.com/upload/media/product/productsearch/datasheet/rchip/PYu-RC_Group_51_RoHS_L_10.pdf; Package / Case: 0603 (1608 Metric); Packaging: CutTape; Size / Dimension: 0.063" L x 0.031" W (1.60mm x 0.80mm); Tolerance: ±1%; PartId: 19106; Device Package: 0603 (1608 Metric); ComponentLink2Description: DigiKey Link; Part Status: Active; Composition: Thick Film; LastUpdated: 9/4/2023 7:33:20 PM; ComponentLink1Description: Datasheet; ComponentLink2URL: https://www.digikey.com/en/products/detail/yageo/RC0603FR-0712K4L/726917; Number of Terminations: 2; Operating Temperature: -55°C ~ 155°C; Resistance: 12.4 kOhms; Height - Seated (Max): 0.022" (0.55mm); Part Number: RC0603FR-0712K4L; Price: 0.01; Series: RC_L; Features: Moisture Resistant
RT1 = CMP-00103-1: Inrush Current Limiter 10 Ohms ±20% 2 A 0.335" (8.50mm)
S1-S3 = CMP-552-000008-2: Switch; Manufacturer_Name: KLS Electronic; Height: 8mm; Manufacturer_Part_Number: KLS7-TS6606-8.0-180; Design Item ID: KLS7-TS6606-8.0-180; Source: SamacSys.SchLib; Datasheet Link: http://www.cnkls.com/admin/product_upload/20120515130927KLS7-TS6606.pdf
ST1-ST4 = CMP-00028-00004-2: M2 PTH (2.5mm), 5mm pad; Pins: 1
TP1-TP29 = CMP-00008-1: 1.2mm round
U1 = CMP-019-00054-1: Converter Offline Buck, Buck-Boost, Flyback Topology 60kHz 10-SSOP; RoHS Compliant: Yes
U2 = CMP-558-000003-1: Linear Voltage Regulator IC Positive Fixed 1 Output 3V3 1A SOT-223-3; Manufacturer Name: Diodes Incorporated; Part Number: AZ1117IH-3.3TRG1; Design Item ID: AZ1117IH-3.3TRG1; ComponentLink1Description: Datasheet; ComponentLink1URL: https://www.diodes.com/assets/Datasheets/AZ1117I.pdf; Source: controller_board.SchLib
U3 = CMP-559-000009-1: -25℃~+90℃ 2mm Nickel Deck MicroSD card (TF card) 260℃ Copper Alloy Self bomb SMD SD Card Connectors ROHS; Manufacturer Name: XKB Connectivity; Design Item ID: XKTF-N02-N; ComponentLink1Description: Datasheet; ComponentLink1URL: https://datasheet.lcsc.com/lcsc/2110151630_XKB-Connectivity-XKTF-N02-N_C381084.pdf; Source: controller_board.SchLib; Part Number: XKTF-N02-N
U4 = CMP-00105-1: Line Transceiver, 1 Func, 1 Driver, 1 Rcvr, BICMOS, PDSO8
U5 = CMP-007-000028-2: Bluetooth, WiFi 802.11b/g/n, Bluetooth v5.0 Transceiver Module 2.4GHz Antenna Not Included, U.FL Surface Mount; Manufacturer_Name: Espressif Systems; Design Item ID: ESP32-C3-WROOM-02U-N4; Datasheet Link: https://www.espressif.com/sites/default/files/documentation/esp32-c3-wroom-02_datasheet_en.pdf; Mouser Price/Stock: https://www.mouser.co.uk/ProductDetail/Espressif-Systems/ESP32-C3-WROOM-02U-N4?qs=pBJMDPsKWf2Ces2aXBSNjQ%3D%3D; Height: 3.35mm; Source: SamacSys.SchLib; Mouser Part Number: 356-ESP32C3WROM02UN4; Manufacturer_Part_Number: ESP32-C3-WROOM-02U-N4
U6 = CMP-559-000005-1: W5500 WIZnet Ethernet Controller 10/100 Base-T/TXPHY SPI Interface 3.3V 132mA 48-LQFP RoHS; Data Rate: 100Mbps; Number of Channels: 8NUMBER; Category: Integrated Circuits (ICs); Design Item ID: W5500; RoHS: Yes; ComponentLink2URL: https://datasheet.ciiva.com/29644/w5500-ds-v100e-29644866.pdf?src-supplier=Digi-Key; ComponentLink1URL: https://datasheet.ciiva.com/24199/w5500-24199988.pdf?src-supplier=Future+Electronics; Manufacturer Part Number: W5500; Height: 1.6mm; ComponentLink1Description: https://datasheet.ciiva.com/24199/w5500-24199988.pdf?src-supplier=Future+Electronics; ComponentLink2Description: https://datasheet.ciiva.com/29644/w5500-ds-v100e-29644866.pdf?src-supplier=Digi-Key; Manufacturer: WIZnet; Source: controller_board.SchLib; Stock: 255; Pricing: 1=3.699 (USD); Nominal Supply Current: 132mA
Y1 = CMP-2000-05733-3: Crystal 25MHz ±20ppm (Tol) ±30ppm (Stability) 18pF FUND 60Ω 4-Pin SMD T/R; Series Resistance: 60R; Length: 3.2mm; Depth: 2.5mm; Packaging: Tape and Reel; Min Operating Temperature: -40°C; Operating Frequency: 25 MHz; Lead Free: Lead Free; Number of Pins: 4; Frequency Tolerance: 20ppm; Radiation Hardening: No; Max Operating Temperature: 85°C; Termination: SMD/SMT; Frequency Stability: 30ppm; Frequency: 25MHz; Series: ABM8G; Mount: Surface Mount; Package Quantity: 1000; Height: 0.039inch; Width: 0.098inch; Case/Package: CSMD; ESR (Equivalent Series Resistance): 60R; Load Capacitance: 18pF; Tolerance: 20ppm